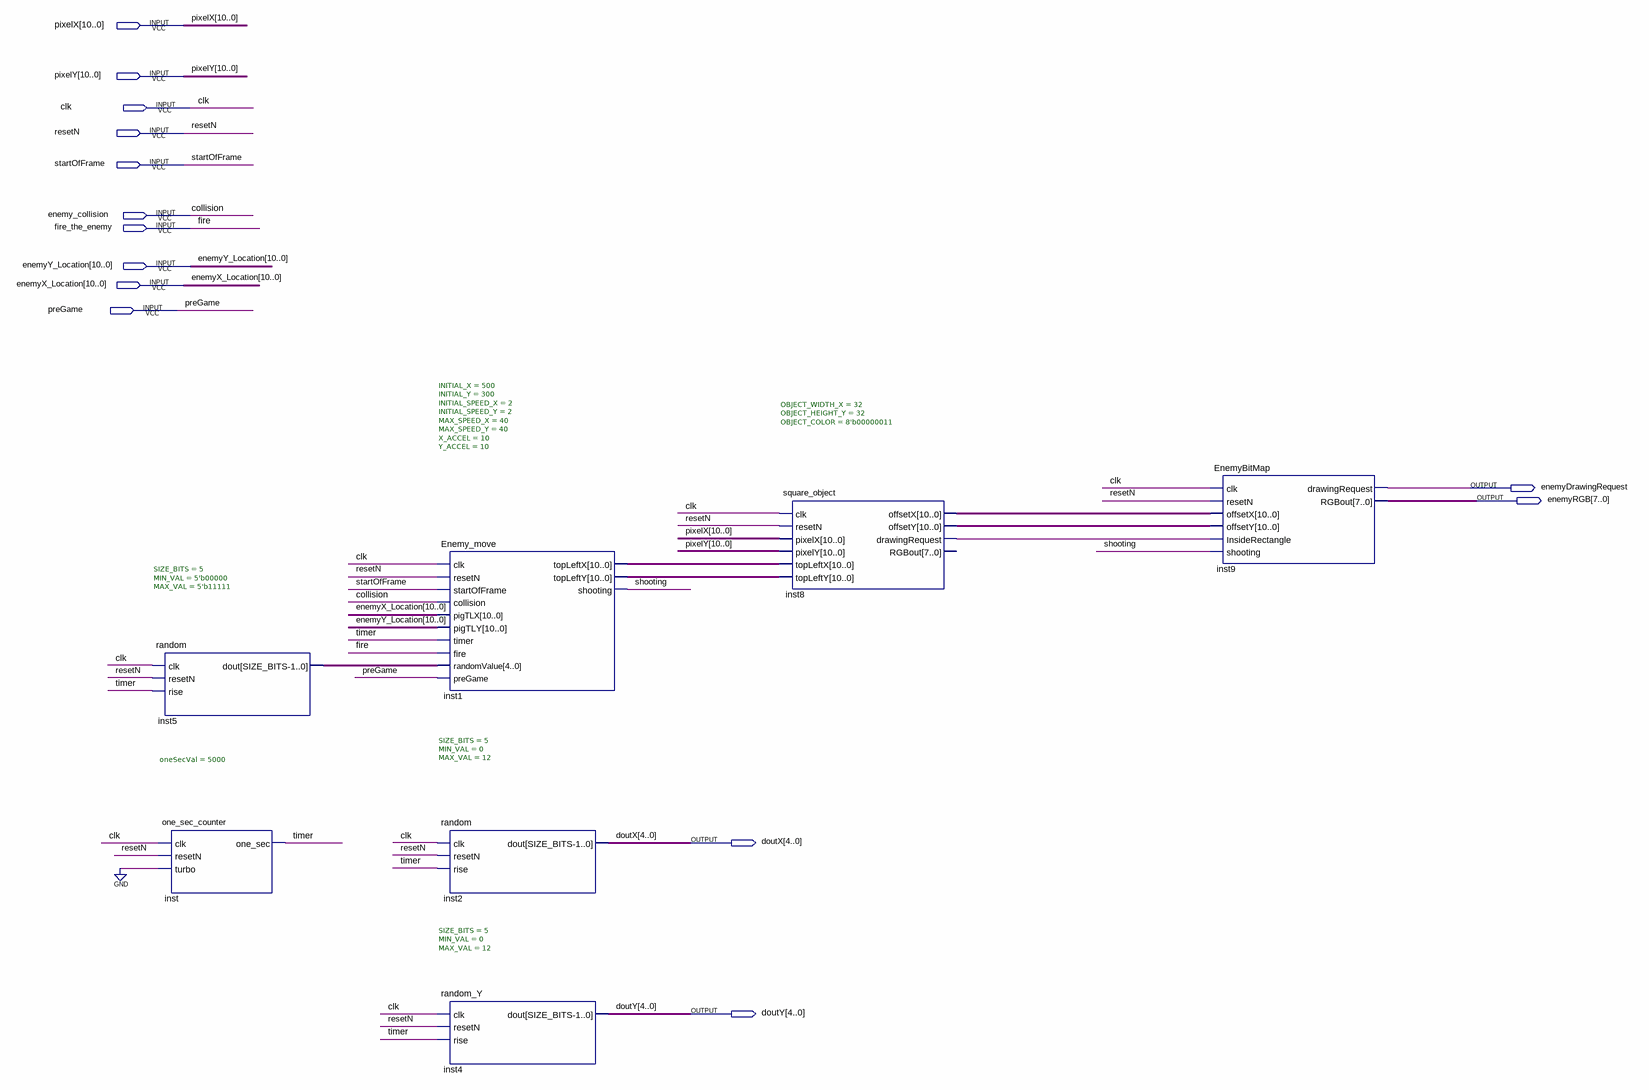
[diagram p0: schematic sheet]
// Quartus schematic Enemy_Block_T.bdf as structural Verilog: 7 symbols, 14 pins
module Enemy_Block_T (
  input  [10:0] pixelX,
  input  [10:0] pixelY,
  input  clk,
  input  resetN,
  input  startOfFrame,
  input  enemy_collision,
  input  fire_the_enemy,
  input  [10:0] enemyY_Location,
  input  [10:0] enemyX_Location,
  input  preGame,
  output enemyDrawingRequest,
  output [7:0] enemyRGB,
  output [4:0] doutX,
  output [4:0] doutY
);

  wire inst8_drawingrequest, shooting, timer;
  wire [4:0] inst5_dout;
  wire [10:0] inst1_topleftx, inst1_toplefty, inst8_offsetx, inst8_offsety;

  random #(.SIZE_BITS(5), .MIN_VAL(5'b00000), .MAX_VAL(5'b11111)) inst5 (
    .clk(clk), .resetN(resetN), .rise(timer), .dout(inst5_dout));
  one_sec_counter #(.oneSecVal(5000)) inst (.clk(clk), .resetN(resetN), .turbo(1'b0), .one_sec(timer));
  Enemy_move #(.INITIAL_X(500), .INITIAL_Y(300), .INITIAL_SPEED_X(2), .INITIAL_SPEED_Y(2), .MAX_SPEED_X(40), .MAX_SPEED_Y(40), .X_ACCEL(10), .Y_ACCEL(10)) inst1 (
    .clk(clk), .resetN(resetN), .startOfFrame(startOfFrame), .collision(enemy_collision),
    .pigTLX(enemyX_Location), .pigTLY(enemyY_Location), .timer(timer), .fire(fire_the_enemy),
    .randomValue(inst5_dout), .preGame(preGame), .topLeftX(inst1_topleftx), .topLeftY(inst1_toplefty),
    .shooting(shooting));
  random #(.SIZE_BITS(5), .MIN_VAL(0), .MAX_VAL(12)) inst2 (.clk(clk), .resetN(resetN), .rise(timer), .dout(doutX));
  random_Y #(.SIZE_BITS(5), .MIN_VAL(0), .MAX_VAL(12)) inst4 (.clk(clk), .resetN(resetN), .rise(timer), .dout(doutY));
  square_object #(.OBJECT_WIDTH_X(32), .OBJECT_HEIGHT_Y(32), .OBJECT_COLOR(8'b00000011)) inst8 (
    .clk(clk), .resetN(resetN), .pixelX(pixelX), .pixelY(pixelY), .topLeftX(inst1_topleftx),
    .topLeftY(inst1_toplefty), .offsetX(inst8_offsetx), .offsetY(inst8_offsety),
    .drawingRequest(inst8_drawingrequest));  // open: RGBout
  EnemyBitMap inst9 (
    .clk(clk), .resetN(resetN), .offsetX(inst8_offsetx), .offsetY(inst8_offsety),
    .InsideRectangle(inst8_drawingrequest), .shooting(shooting), .drawingRequest(enemyDrawingRequest),
    .RGBout(enemyRGB));

  // Other names for the same wires on the sheet: collision = enemy_collision; fire = fire_the_enemy
endmodule
